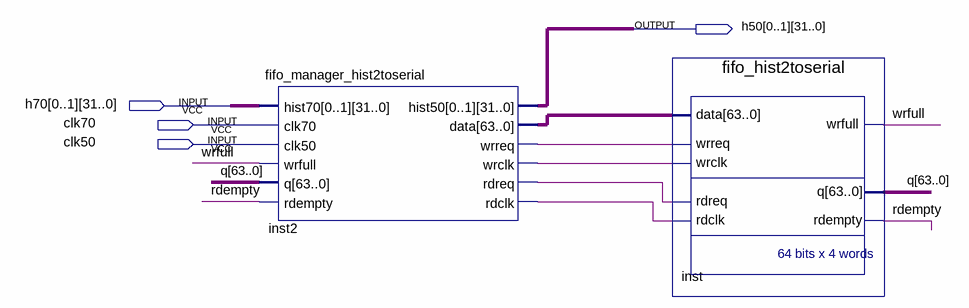
[diagram p0: schematic sheet]
// Quartus schematic fifo_70_to_50.bdf as structural Verilog: 2 symbols, 4 pins
module fifo_70_to_50 (
  input  [31:0] h70_0,
  input  [31:0] h70_1,
  input  clk70,
  input  clk50,
  output [31:0] h50_0,
  output [31:0] h50_1
);

  wire inst2_rdclk, inst2_rdreq, inst2_wrclk, inst2_wrreq, rdempty, wrfull;
  wire [63:0] inst2_data, q;

  fifo_manager_hist2toserial inst2 (
    .hist70({h70_0, h70_1}), .clk70(clk70), .clk50(clk50), .wrfull(wrfull), .q(q), .rdempty(rdempty),
    .hist50({h50_0, h50_1}), .data(inst2_data), .wrreq(inst2_wrreq), .wrclk(inst2_wrclk),
    .rdreq(inst2_rdreq), .rdclk(inst2_rdclk));
  fifo_hist2toserial inst (
    .data(inst2_data), .wrreq(inst2_wrreq), .wrclk(inst2_wrclk), .rdreq(inst2_rdreq), .rdclk(inst2_rdclk),
    .wrfull(wrfull), .q(q), .rdempty(rdempty));
endmodule
